# Altium schematic sheet Server_CPU_SerDes.SchDoc
size D
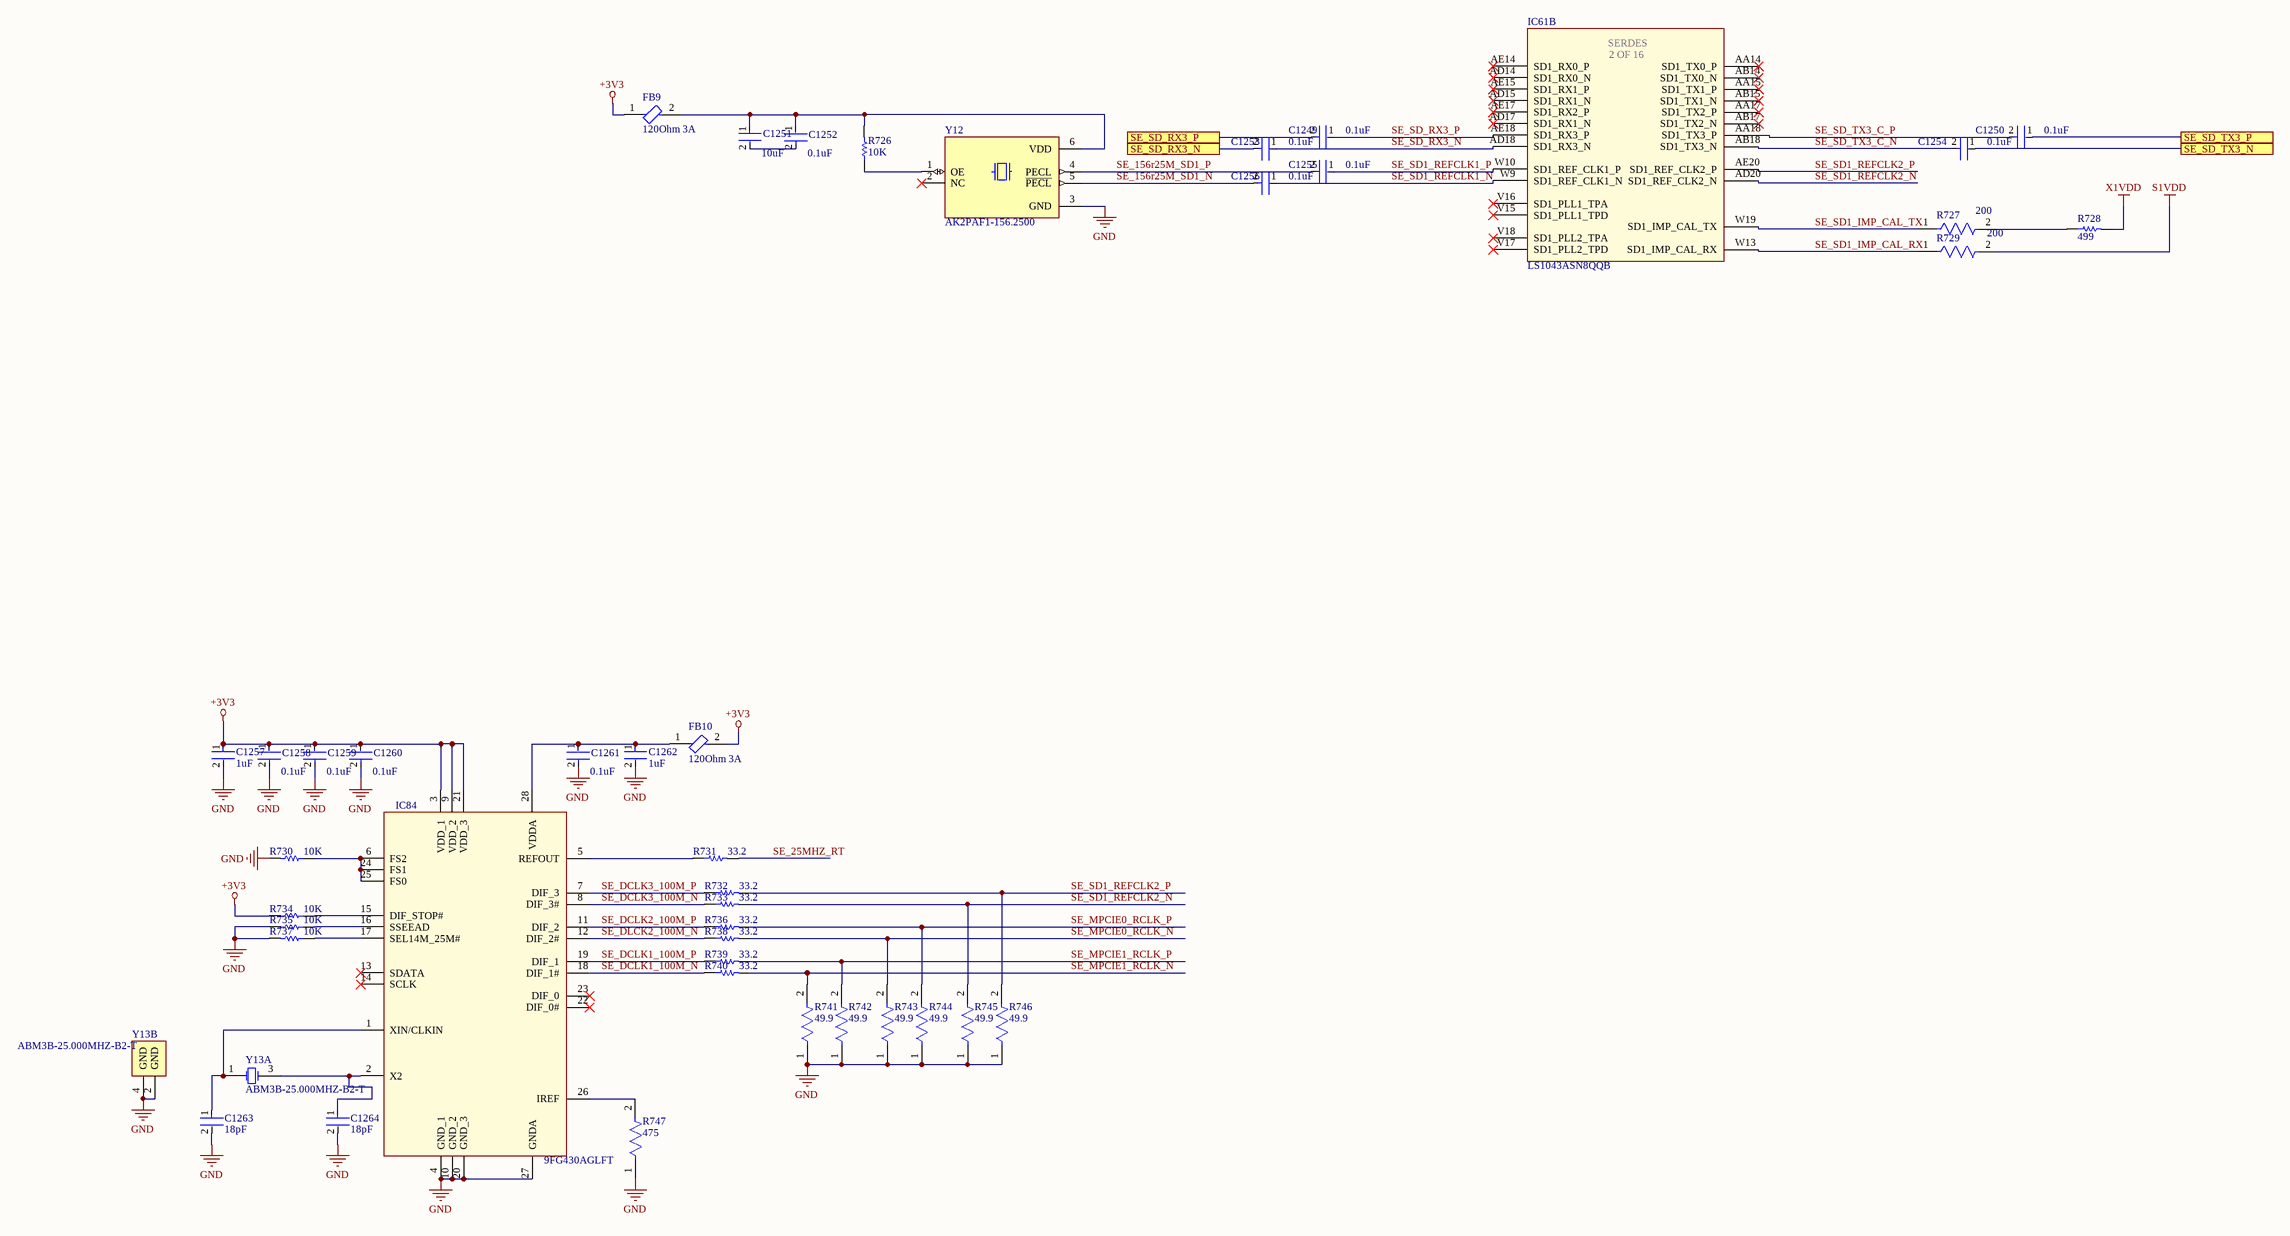
[diagram p0: Server_CPU_SerDes.SchDoc]

## Parts
C1249  0.1uF  [FP-GRM15-MFG]
C1250  0.1uF  [FP-GRM15-MFG]
C1251  10uF  [FP-C0805C-DG-MFG]
C1252  0.1uF  [FP-GRM15-MFG]
C1253  0.1uF  [FP-GRM15-MFG]
C1254  0.1uF  [FP-GRM15-MFG]
C1255  0.1uF  [FP-GRM15-MFG]
C1256  0.1uF  [FP-GRM15-MFG]
C1257  1uF  [FP-GRM15-0_1-MFG]
C1258  0.1uF  [FP-GRM15-MFG]
C1259  0.1uF  [FP-GRM15-MFG]
C1260  0.1uF  [FP-GRM15-MFG]
C1261  0.1uF  [FP-GRM15-MFG]
C1262  1uF  [FP-GRM15-0_1-MFG]
C1263  18pF  [FP-C0402-BB-MFG]
C1264  18pF  [FP-C0402-BB-MFG]
FB9  120Ohm 3A  [FP-BLM18-0_15-t0_5-d1_2-MFG]
FB10  120Ohm 3A  [FP-BLM18-0_15-t0_5-d1_2-MFG]
IC61  LS1043ASN8QQB  [BGA780C80P28X28_2300X2300X261]  (part B of 16)
IC84  9FG430AGLFT  [SOP65P640X120-28N]
R726  10K  [RESC1005X40X25LL05T05]
R727  200  [FP-CRCW0402-e3-IPC_C]
R728  499  [RESC1005X40X25LL05T05]
R729  200  [FP-CRCW0402-e3-IPC_C]
R730  10K  [RESC1005X40X25LL05T05]
R731  33.2  [RESC1005X40X25LL05T05]
R732  33.2  [RESC1005X40X25LL05T05]
R733  33.2  [RESC1005X40X25LL05T05]
R734  10K  [RESC1005X40X25LL05T05]
R735  10K  [RESC1005X40X25LL05T05]
R736  33.2  [RESC1005X40X25LL05T05]
R737  10K  [RESC1005X40X25LL05T05]
R738  33.2  [RESC1005X40X25LL05T05]
R739  33.2  [RESC1005X40X25LL05T05]
R740  33.2  [RESC1005X40X25LL05T05]
R741  49.9  [FP-CRCW0402-e3-MFG]
R742  49.9  [FP-CRCW0402-e3-MFG]
R743  49.9  [FP-CRCW0402-e3-MFG]
R744  49.9  [FP-CRCW0402-e3-MFG]
R745  49.9  [FP-CRCW0402-e3-MFG]
R746  49.9  [FP-CRCW0402-e3-MFG]
R747  475  [FP-CRCW0603-e3-IPC_C]
Y12  AK2PAF1-156.2500  [XTAL_AK2PAF1-156.2500]
Y13  ABM3B-25.000MHZ-B2-T  [ABRA-ABM3B-4_V]  (parts A,B of 2)

## Ports
SE_SD_RX3_N, SE_SD_RX3_P, SE_SD_TX3_N, SE_SD_TX3_P

## Nets
+3V3: C1257.1 C1258.1 C1259.1 C1260.1 FB9.1 FB10.2 IC84.3(VDD_1) IC84.9(VDD_2) IC84.21(VDD_3) R734.2
GND: C1257.2 C1258.2 C1259.2 C1260.2 C1261.2 C1262.2 C1263.2 C1264.2 IC84.4(GND_1) IC84.10(GND_2) IC84.20(GND_3) IC84.27(GNDA) R730.2 R735.2 R737.2 R741.1 R742.1 R743.1 R744.1 R745.1 R746.1 R747.1 Y12.3(GND) Y13.2(GND) Y13.4(GND)
S1VDD: R729.2
X1VDD: R728.2
SE_25MHZ_RT: R731.2
SE_156r25M_SD1_N: C1256.2 Y12.5(~{PECL})
SE_156r25M_SD1_P: C1255.2 Y12.4(PECL)
SE_DCLK1_100M_N: IC84.18(DIF_1#) R740.1
SE_DCLK1_100M_P: IC84.19(DIF_1) R739.1
SE_DCLK2_100M_P: IC84.11(DIF_2) R736.1
SE_DCLK3_100M_N: IC84.8(DIF_3#) R733.1
SE_DCLK3_100M_P: IC84.7(DIF_3) R732.1
SE_DLCK2_100M_N: IC84.12(DIF_2#) R738.1
SE_MPCIE0_RCLK_N: R738.2 R743.2
SE_MPCIE0_RCLK_P: R736.2 R744.2
SE_MPCIE1_RCLK_N: R740.2 R741.2
SE_MPCIE1_RCLK_P: R739.2 R742.2
SE_SD1_IMP_CAL_RX: IC61.W13(SD1_IMP_CAL_RX) R729.1
SE_SD1_IMP_CAL_TX: IC61.W19(SD1_IMP_CAL_TX) R727.1
SE_SD1_REFCLK1_N: C1256.1 IC61.W9(SD1_REF_CLK1_N)
SE_SD1_REFCLK1_P: C1255.1 IC61.W10(SD1_REF_CLK1_P)
SE_SD1_REFCLK2_N: IC61.AD20(SD1_REF_CLK2_N) R733.2 R745.2
SE_SD1_REFCLK2_P: IC61.AE20(SD1_REF_CLK2_P) R732.2 R746.2
SE_SD_RX3_N: C1253.1 IC61.AD18(SD1_RX3_N)
SE_SD_RX3_N: C1253.2 ; port SE_SD_RX3_N  [a separate net that carries the same name]
SE_SD_RX3_P: C1249.1 IC61.AE18(SD1_RX3_P)
SE_SD_RX3_P: C1249.2 ; port SE_SD_RX3_P  [a separate net that carries the same name]
SE_SD_TX3_C_N: C1254.2 IC61.AB18(SD1_TX3_N)
SE_SD_TX3_C_P: C1250.2 IC61.AA18(SD1_TX3_P)
SE_SD_TX3_N: C1254.1 ; port SE_SD_TX3_N
SE_SD_TX3_P: C1250.1 ; port SE_SD_TX3_P
NetC1251_1: C1251.1 C1252.1 FB9.2 R726.2 Y12.6(VDD)
NetC1251_2: C1251.2 C1252.2
NetC1261_1: C1261.1 C1262.1 FB10.1 IC84.28(VDDA)
NetC1263_1: C1263.1 IC84.1(XIN/CLKIN) Y13.1(X1)
NetC1264_1: C1264.1 IC84.2(X2) Y13.3(X2)
NetIC84_5: IC84.5(REFOUT) R731.1
NetIC84_6: IC84.6(FS2) IC84.24(FS1) IC84.25(FS0) R730.1
NetIC84_15: IC84.15(DIF_STOP#) R734.1
NetIC84_16: IC84.16(SSEEAD) R735.1
NetIC84_17: IC84.17(SEL14M_25M#) R737.1
NetIC84_26: IC84.26(IREF) R747.2
NetR726_1: R726.1 Y12.1(OE)
NetR727_2: R727.2 R728.1

Not connected (* = marked no-connect by the designer): IC61 AA14(SD1_TX0_P)* AA15(SD1_TX1_P)* AA17(SD1_TX2_P)* AB14(SD1_TX0_N)* AB15(SD1_TX1_N)* AB17(SD1_TX2_N)* AD14(SD1_RX0_N)* AD15(SD1_RX1_N)* AD17(SD1_RX1_N)* AE14(SD1_RX0_P)* AE15(SD1_RX1_P)* AE17(SD1_RX2_P)* V15(SD1_PLL1_TPD)* V16(SD1_PLL1_TPA)* V17(SD1_PLL2_TPD)* V18(SD1_PLL2_TPA)*; IC84 13(SDATA)* 14(SCLK)* 22(DIF_0#)* 23(DIF_0)*; Y12 2(NC)*

## Notes on the sheet
- (in symbol LS1043ASN8QQB, part B) SERDES; 2 OF 16

## Library data of the parts
C1249 C1250 C1252-C1256 C1258-C1261 = CMP-2100-03641-2: CAP CER 0.1UF 16V X7R 0402; Manufacturer Part Number: GRM155R71C104KA88D; Manufacturer: Murata; Standoff Height: 0mm; Tolerance: 10%; Voltage Rating: 16Vdc; Material: Ceramic; Capacitance: 0.10μF; Value: 0.10μF; RoHS: TRUE; Temperature Characteristic: X7R; Octopart: https://octopart.com/grm155r71c104ka88d-murata-196880; Digikey Description: CAP CER 0.1UF 16V X7R 0402; Device Class L3: Ceramic Capacitors; Height: 0.55mm; ComponentLink2Description: Datasheet; Temperature Range Low: -55°C; Ipc Land Pattern Name: CAPC10050X219; ComponentLink2URL: https://search.murata.co.jp/Ceramy/image/img/A01X/G101/ENG/GRM155R71H471KA01-01A.pdf; Device Class L1: Passive Components; Lead Free: yes; Category: Cap; Package: GRM15; Temperature: -55°C to +125°C; Device Class L2: Capacitors; Temperature Range High: +125°C; Mouser Description: 0402 0.1 uF 16V ±10 % Tolerance X7R SMT Multilayer Ceramic Capacitor
C1251 = CMP-2007-03243-2: CAP CER 10UF 10V X5R 0805; Manufacturer Part Number: C0805C106K8PACTU; Manufacturer: Kemet; 3DS Part Number: 220-00001; Tolerance: 10%; Temperature Coefficient: 15%; Material: Ceramic; Device Class L2: Capacitors; Device Class L1: Passive Components; ComponentLink2URL: https://content.kemet.com/datasheets/KEM_C1006_X5R_SMD.pdf; Height: 1.4mm; Lead Free: Yes; Digikey Description: CAP CER 10UF 10V X5R 0805; Octopart: https://octopart.com/c0805c106k8pactu-kemet-98697; Capacitance: 10uF; Value: 10uF; Temperature Range Low: -55°C; Temperature: -55°C to +85°C; Automotive: No; Mouser Description: CAP CER 10UF 10V X5R 0805; Ipc Land Pattern Name: CAPC200125X125; Temperature Range High: +85°C; Voltage: 10V; RoHS: TRUE; Device Class L3: Ceramic Capacitors; ComponentLink2Description: Datasheet; Voltage Rating: 10V; Package: C0805C-DG; Temperature Characteristic: X5R; Category: Cap
C1257 C1262 = CMP-2008-04556-2: CAP CER 1UF 10V X5R 0402; Manufacturer Part Number: GRM155R61A105KE15D; Manufacturer: Murata; Material: Ceramic; Tolerance: 10%; Temperature Coefficient: 15%; Octopart: https://octopart.com/grm155r61a105ke15d-murata-197442; Lead Free: Yes; ComponentLink2Description: Datasheet; Temperature: -55°C to +85°C; Temperature Range High: +85°C; Height: 0.55mm; Capacitance: 1uF; Ipc Land Pattern Name: CAPC10050X50; ComponentLink2URL: https://search.murata.co.jp/Ceramy/image/img/A01X/G101/ENG/GRM155R61A105KE15-01A.pdf; Temperature Range Low: -55°C; Device Class L2: Capacitors; Voltage Rating: 10V; RoHS: TRUE; Device Class L1: Passive Components; Device Class L3: Ceramic Capacitors; Temperature Characteristic: X5R; Mouser Description: 0402 1 uF 10 V ±10% Tolerance X5R Surface Mount Multilayer Ceramic Capacitor; Automotive: No; Package: GRM15-0.1; Digikey Description: CAP CER 1UF 10V X5R 0402; Value: 1uF; Category: Cap
C1263 C1264 = CMP-2008-03288-2: CAP CER 18PF 50V 5% NP0 0402; Manufacturer Part Number: C0402C180J5GACTU; Manufacturer: Kemet; Temperature Coefficient: 15%; Temperature Characteristic: C0G; Tolerance: 0.05; Material: Ceramic; Ipc Land Pattern Name: CAPC10050X50; Capacitance: 18 pF; Category: Cap; RoHS: TRUE; Automotive: No; Temperature Range High: +125°C; Height: 0.55mm; ComponentLink2Description: Datasheet; Lead Free: Yes; Value: 18 pF; Device Class L3: Ceramic Capacitors; Device Class L1: Passive Components; Digikey Description: CAP CER 18PF 50V 5% NP0 0402; Device Class L2: Capacitors; Voltage Rating: 50 V; ComponentLink2URL: https://content.kemet.com/datasheets/KEM_C1002_X7R_SMD.pdf; Octopart: https://octopart.com/c0402c180j5gactu-kemet-9138803; Mouser Description: Multilayer Ceramic Capacitors MLCC - SMD/SMT 50volts 18pF C0G 5%; Temperature: -55°C to +125°C; Temperature Range Low: -55°C; Package: C0402-BB
FB9 FB10 = CMP-0686-00602-4: Chip Ferrite Bead, 0603, 120Ω @ 100MHz, 25%, 0.025Ω, 3A; DC Resistance (DCR): 25mR; Shielding: Unshielded; Material: Steel; Number of Circuits: 1; Impedance: 120R; Tolerance: 25%; REACH SVHC: No SVHC; Case/Package: 0603; Max DC Current: 3A; Core Material: Ferrite; Case Code (Metric): 1608; Frequency: 100MHz; Package Quantity: 1; Height: 0.8mm; Lead Free: Lead Free; Test Frequency: 100MHz; RoHS Compliant: Yes; DC Resistance-Max: 25mR; Min Operating Temperature: -55°C; Width: 0.8mm; Termination: SMD/SMT; Length: 1.6mm; Max Current Rating: 3A; Number of Lines: 1; Series: BLM18S; Number of Pins: 2; Packaging: Tape and Reel; Current Rating: 3A; Depth: 0.8mm; Case Code (Imperial): 0603; Max Operating Temperature: 125°C
IC61 = LS1043ASN8QQB: Integrated Circuit; Manufacturer_Name: NXP; Datasheet Link: http://www.nxp.com/secured/assets/documents/en/data-sheet/LS1088A.pdf; Height: 2.61mm; Manufacturer_Part_Number: LS1043ASN8QQB; Mouser Part Number: 771-LS1043ASN8QQB; Mouser Price/Stock: https://www.mouser.co.uk/ProductDetail/NXP-Semiconductors/LS1043ASN8QQB/?qs=AQlKX63v8RsTATOTx7X0Jg%3D%3D
IC84 = 9FG430AGLFT: Integrated Circuit; Manufacturer_Name: IDT; Datasheet Link: https://www.idt.com/document/dst/9fg430-datasheet; Height: 1.2mm; Manufacturer_Part_Number: 9FG430AGLFT
R726 R730 R734 R735 R737 = CMP-2000-07588-1: Chip Resistor, 10 KOhm, +/- 1%, 0.1 W, -55 to 155 degC, 0402 (1005 Metric), RoHS, Tape and Reel; Manufacturer: Panasonic; Power Rating: 100mW; Voltage Rating: 50V; Resistance: 10KOhm; Case\/Package: 0402; Temperature Coefficient: 100ppm\/degreesC; RoHSCompliant: True; Lead Free: LeadFree; Package Quantity: 1; Contact Plating: Tin; Length: 1mm; Radiation Hardening: No; REACH SVHC: NoSVHC; Max Operating Temperature: 155degC; Depth: 0.5mm; Case Code (Imperial): 0402; Military Standard: Not; Package Description: 2-Pin Surface Mount Device, Body 1 x 0.5 mm; Termination: SMD/SMT; Case Code (Metric): 1005; Height: 0.35mm; Packaging: TapeandReel; Voltage Rating (DC): 50V; Package Reference: 402; Number of Pins: 2; Tolerance: 1%; Mounting Technology: SurfaceMount; Width: 0.02inch; Mount: SurfaceMount; Datasheet URL: https://industrial.panasonic.com/cdbs/www-data/pdf/RDA0000/AOA0000C304.pdf; Composition: ThickFilm; Datasheet Version: 02/2017; Manufacturer URL: http://www.panasonic.com/; Max Power Dissipation: 100mW; Number of Terminations: 2; Min Operating Temperature: -55degC
R727 R729 = CMP-1011-00429-3: RES Thick Film, 200Ω, 1%, 0.063W, 100ppm/°C, 0402; Max Power Dissipation: 63mW; Voltage Rating: 50V; Resistance: 200R; Termination: SMD/SMT; Weight: 2.3E-05oz; Case/Package: 0402; Contact Plating: Tin; Number of Pins: 2; Width: 0.5mm; Height: 0.35mm; Case Code (Metric): 1005; Military Standard: Not; Features: Automotive AEC-Q200; Power Rating: 63mW; Temperature Coefficient: 100ppm/°C; Tolerance: 1%; Lead Free: Lead Free; Depth: 0.5mm; Max Operating Temperature: 155°C; Min Operating Temperature: -55°C; Package Quantity: 10; Voltage Rating (DC): 50V; Composition: Thick Film; Mount: Surface Mount; Radiation Hardening: No; Length: 1mm; Packaging: Tape and Reel; Number of Terminations: 2; Case Code (Imperial): 0402
R728 = CMP-2002-00965-1: Manufacturer: Panasonic; Part Number: ERJ-2RKF4990X
R731-R733 R736 R738-R740 = CMP-2002-08532-1: Part Number: CRCW040233R2FKED; Manufacturer: Vishay Dale
R741-R746 = CMP-1011-00363-3: RES Thick Film, 49.9Ω, 1%, 0.063W, 100ppm/°C, 0402; Resistance: 49.9R; Voltage Rating: 50V; Power Rating: 63mW; Temperature Coefficient: 100ppm/°C; Packaging: Tape and Reel; Height: 0.35mm; Length: 1mm; Case Code (Metric): 1005; Weight: 2.3E-05oz; Case Code (Imperial): 0402; Voltage Rating (DC): 50V; Composition: Thick Film; Lead Free: Lead Free; Package Quantity: 10; Number of Terminations: 2; Width: 0.5mm; Max Operating Temperature: 155°C; Depth: 0.5mm; Max Power Dissipation: 63mW; Tolerance: 1%; Radiation Hardening: No; Features: Automotive AEC-Q200; Min Operating Temperature: -55°C; Contact Plating: Tin; Mount: Surface Mount; Military Standard: Not; Termination: SMD/SMT; Case/Package: 0402
R747 = CMP-2000-03377-2: RES Thick Film, 475Ω, 1%, 0.1W, 100ppm/°C, 0603; Voltage Rating (DC): 75V; Power Rating: 100mW; Resistance: 475R; Termination: SMD/SMT; Weight: 7.1E-05oz; Case Code (Imperial): 0603; Tolerance: 1%; Case/Package: 0603; Length: 1.55mm; Case Code (Metric): 1608; Packaging: Tape and Reel; Max Operating Temperature: 155°C; Width: 0.033inch; Temperature Coefficient: 100ppm/°C; Contact Plating: Tin; Composition: Thick Film; Voltage Rating: 75V; Number of Terminations: 2; Depth: 0.85mm; Lead Free: Lead Free; Height: 0.45mm; Features: Automotive AEC-Q200; Package Quantity: 10; Military Standard: Not; Max Power Dissipation: 100mW; Radiation Hardening: No; Min Operating Temperature: -55°C; Mount: Surface Mount
Y12 = AK2PAF1-156.2500: XTAL OSC XO 156.25MHZ 3.3V LVPEC.   MANUFACTURER: ABRACON; MF: {'manufacturer': u'Abracon LLC'}; Package: None; MP: AK2PAF1-156.2500; Availability: Unavailable; Price: None; Value: *
Y13 = CMP-0277-00001-1: Crystal, SMD, 25.000000MHz Stab=50ppm 18.0pF; Manufacturer: Abracon; Packing Type: Tape & Reel; Body Shape: Rectangular; Case Size: 5.0 x 3.2 mm; PackageDescription: 4-Pin SMT Crystal, 5.2 x 3.4 mm Body; ComponentLink2Description: Datasheet; Mounting Technology: Surface Mount; ComponentLink1URL: http://www.abracon.com/; PackageReference: ABM3B; DatasheetVersion: Apr-13; PartNumber: ABM3B-25.000MHZ-B2-T; ComponentLink2URL: http://www.abracon.com/Resonators/abm3b.pdf; ComponentLink1Description: Manufacturer URL; Storage Temperature: -40 to 80 degC